# EAGLE design pogojig (EAGLE 6.4)
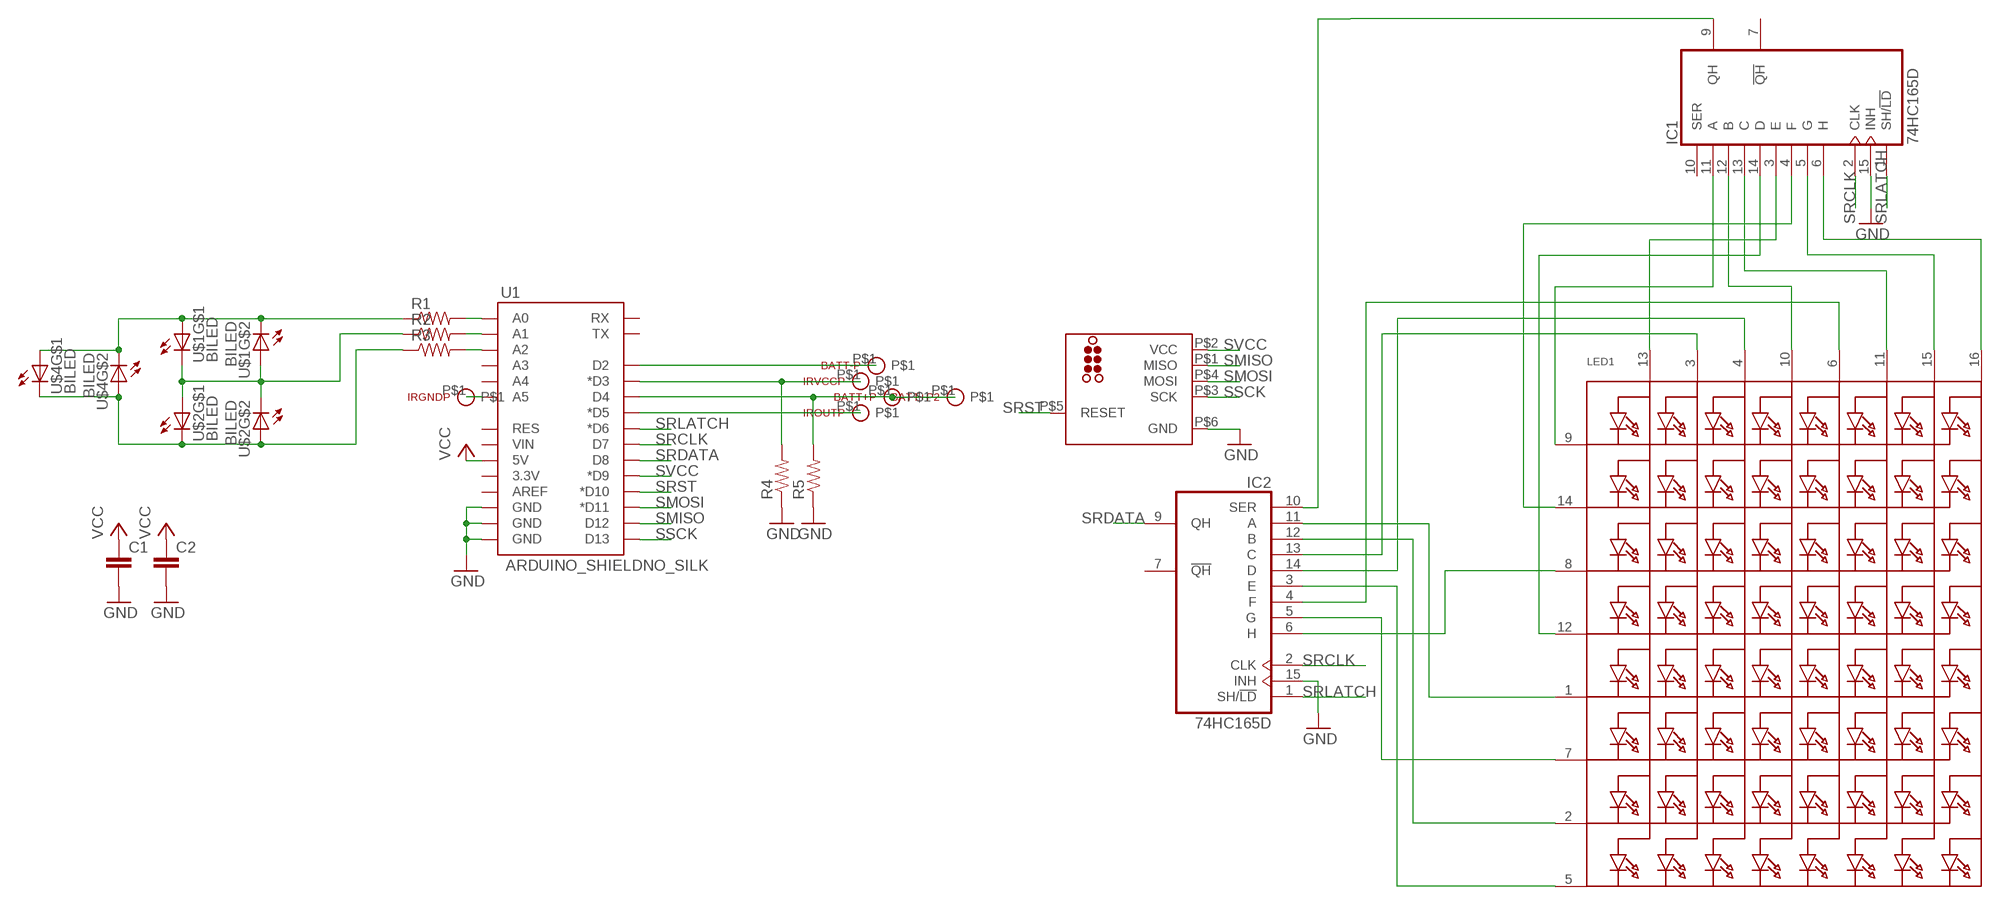
[diagram p0: schematic, sheet 1]

## Parts
BATT+P  POGOPIN1.02  [POGOPIN-1.02]
BATT+P2  POGOPIN1.02  [POGOPIN-1.02]
BATT-P  POGOPIN1.02  [POGOPIN-1.02]
C1  CAP0805  [0805]
C2  CAP0805  [0805]
IC1  74HC165D  [SO16]
IC2  74HC165D  [SO16]
IRGNDP  POGOPIN1.02  [POGOPIN-1.02]
IROUTP  POGOPIN1.02  [POGOPIN-1.02]
IRVCCP  POGOPIN1.02  [POGOPIN-1.02]
LED1  SEGMENT_8X8_ROWCATHODE  [SEGMENT-30MM-POGO]
R1  RESISTOR0805-RES  [0805]
R2  RESISTOR0805-RES  [0805]
R3  RESISTOR0805-RES  [0805]
R4  RESISTOR0805-RES  [0805]
R5  RESISTOR0805-RES  [0805]
U1  ARDUINO_SHIELDNO_SILK  [DUEMILANOVE_VIAS]
U$1  BILED  [BILED]
U$2  BILED  [BILED]
U$3  TC2030_AVR  [TC2030-MCP-NL-POGO]
U$4  BILED  [BILED]

## Nets
GND: C1.2 C2.2 IC1.15(INH) IC2.15(INH) R4.1 R5.1 U1.GND@0(GND) U1.GND@1(GND) U1.GND@2(GND) U$3.P$6(GND)
N$1: IC2.11(A) LED1.1(K5)
N$2: IC2.12(B) LED1.2(K7)
N$3: IC2.13(C) LED1.3(A2)
N$4: IC2.14(D) LED1.4(A3)
N$5: IC2.3(E) LED1.5(K8)
N$6: IC2.4(F) LED1.6(A5)
N$7: IC1.14(D) LED1.12(K4)
N$8: IC2.5(G) LED1.7(K6)
N$9: IC2.6(H) LED1.8(K3)
N$10: IC1.11(A) LED1.9(K1)
N$11: IC1.12(B) LED1.10(A4)
N$12: IC1.13(C) LED1.11(A6)
N$13: IC1.3(E) LED1.13(A1)
N$14: IC1.4(F) LED1.14(K2)
N$15: IC1.5(G) LED1.15(A7)
N$16: IC1.6(H) LED1.16(A8)
N$17: IC1.9(QH) IC2.10(SER)
N$18: IRGNDP.P$1 U1.A5
N$19: BATT+P2.P$1 BATT+P.P$1 R5.2 U1.D4
N$20: BATT-P.P$1 U1.D2
N$21: IRVCCP.P$1 R4.2 U1.D3(*D3)
N$22: IROUTP.P$1 U1.D5(*D5)
N$23: R3.2 U1.A2
N$24: R2.2 U1.A1
N$25: R1.2 U1.A0
N$26: R3.1 U$2.A2(A) U$2.C1(C) U$4.A2(A) U$4.C1(C)
N$27: R1.1 U$1.A1(A) U$1.C2(C) U$4.A1(A) U$4.C2(C)
N$28: R2.1 U$1.A2(A) U$1.C1(C) U$2.A1(A) U$2.C2(C)
SMISO: U1.D12 U$3.P$1(MISO)
SMOSI: U1.D11(*D11) U$3.P$4(MOSI)
SRCLK: IC1.2(CLK) IC2.2(CLK) U1.D7
SRDATA: IC2.9(QH) U1.D8
SRLATCH: IC1.1(SH/!LD) IC2.1(SH/!LD) U1.D6(*D6)
SRST: U1.D10(*D10) U$3.P$5(RESET)
SSCK: U1.D13 U$3.P$3(SCK)
SVCC: U1.D9(*D9) U$3.P$2(VCC)
VCC: C1.1 C2.1 U1.5V
Unconnected: IC1.7(!QH) IC1.10(SER) IC2.7(!QH) U1.3.3V U1.A3 U1.A4 U1.AREF U1.RES U1.RX U1.TX U1.VIN

## Power pins joined to a net without a drawn wire
GND: IC1.8(GND) IC2.8(GND)
VCC: IC1.16(VCC) IC2.16(VCC)

## Library data of the parts
BATT+P BATT+P2 BATT-P IRGNDP IROUTP IRVCCP = nickparts:POGOPIN
C1 C2 = SparkFun-Passives:CAP: Capacitor Standard 0603 ceramic capacitor, and 0.1" leaded capacitor.
IC1 IC2 = 74xx-eu:74*165: 8-bit parallel load SHIFT REGISTER
LED1 = nickparts:SEGMENT_8X8_ROWCATHODE: 8x8 LED Segment Displays: Row = Cathode 0.7" Red 8X8 Matrix, 1.9mm Round LEDs - BL-M07C881UR 1.2" Red 8x8 Matrix, 3.0mm Round LEDs - BL-M12A881UR 1.2" Red 8x8 Matrix, 3.0mm Square LEDs - BL-M12A883
R1-R5 = SparkFun-Passives:RESISTOR: Resistor Basic schematic elements and footprints for 0603, 1206, and PTH resistors.
U1 = SparkFun-Boards:ARDUINO_SHIELD: Arduino shield footprint
U$1 U$2 U$4 = nickparts:BILED
U$3 = nickparts:TC2030_AVR

## Board
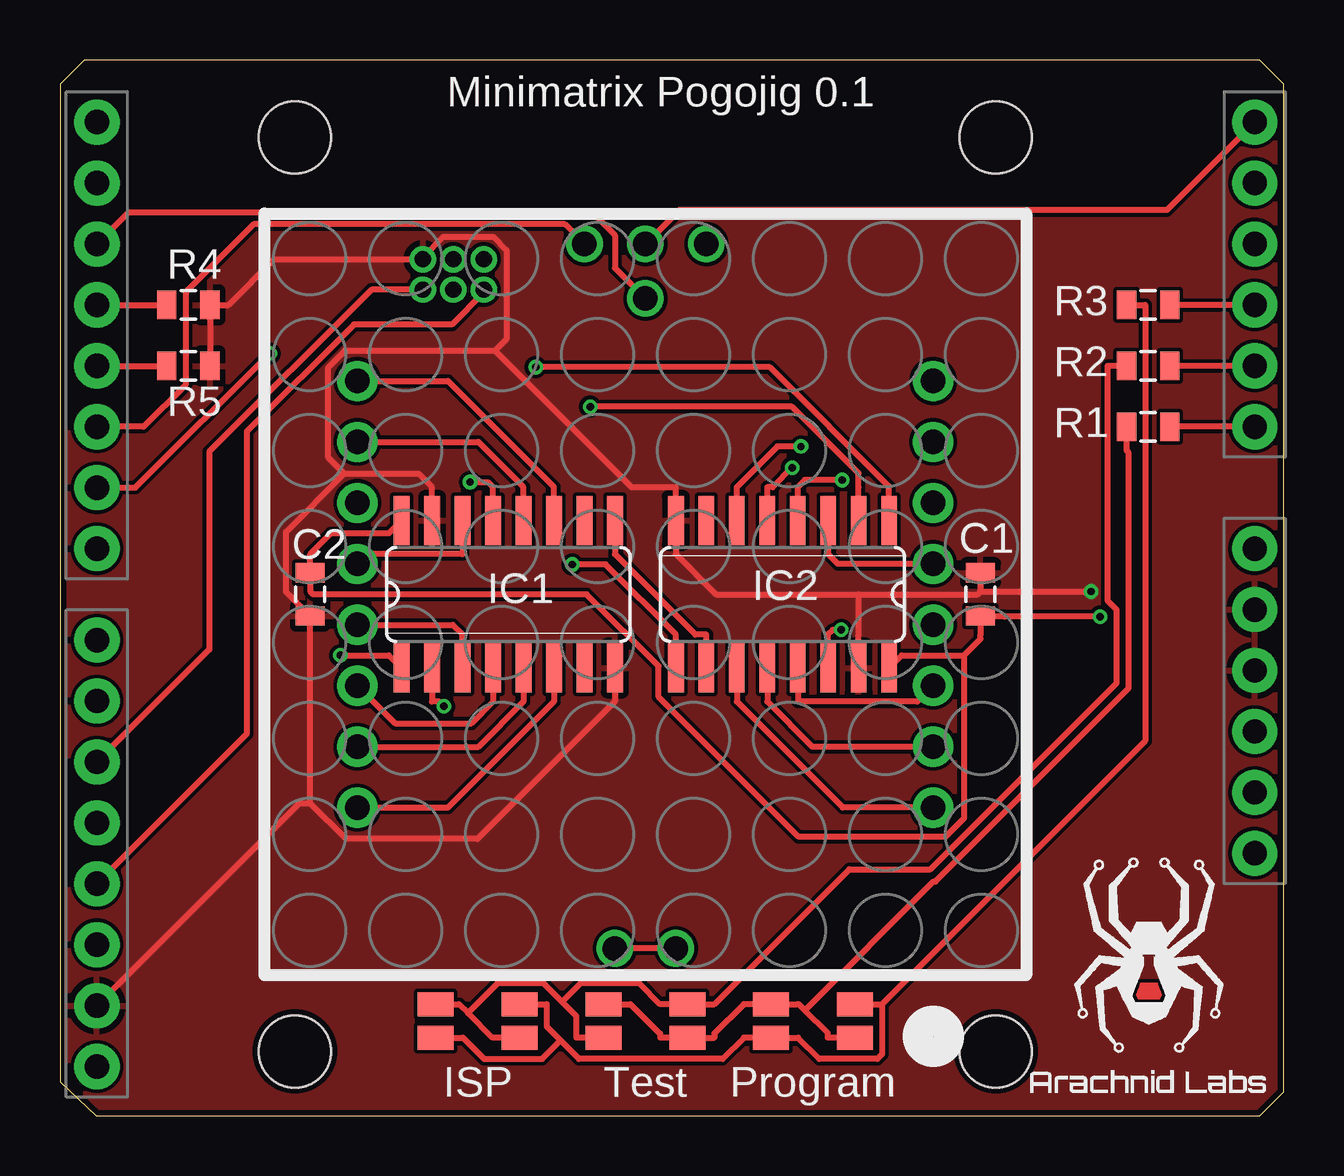
[diagram p1: board, top side]
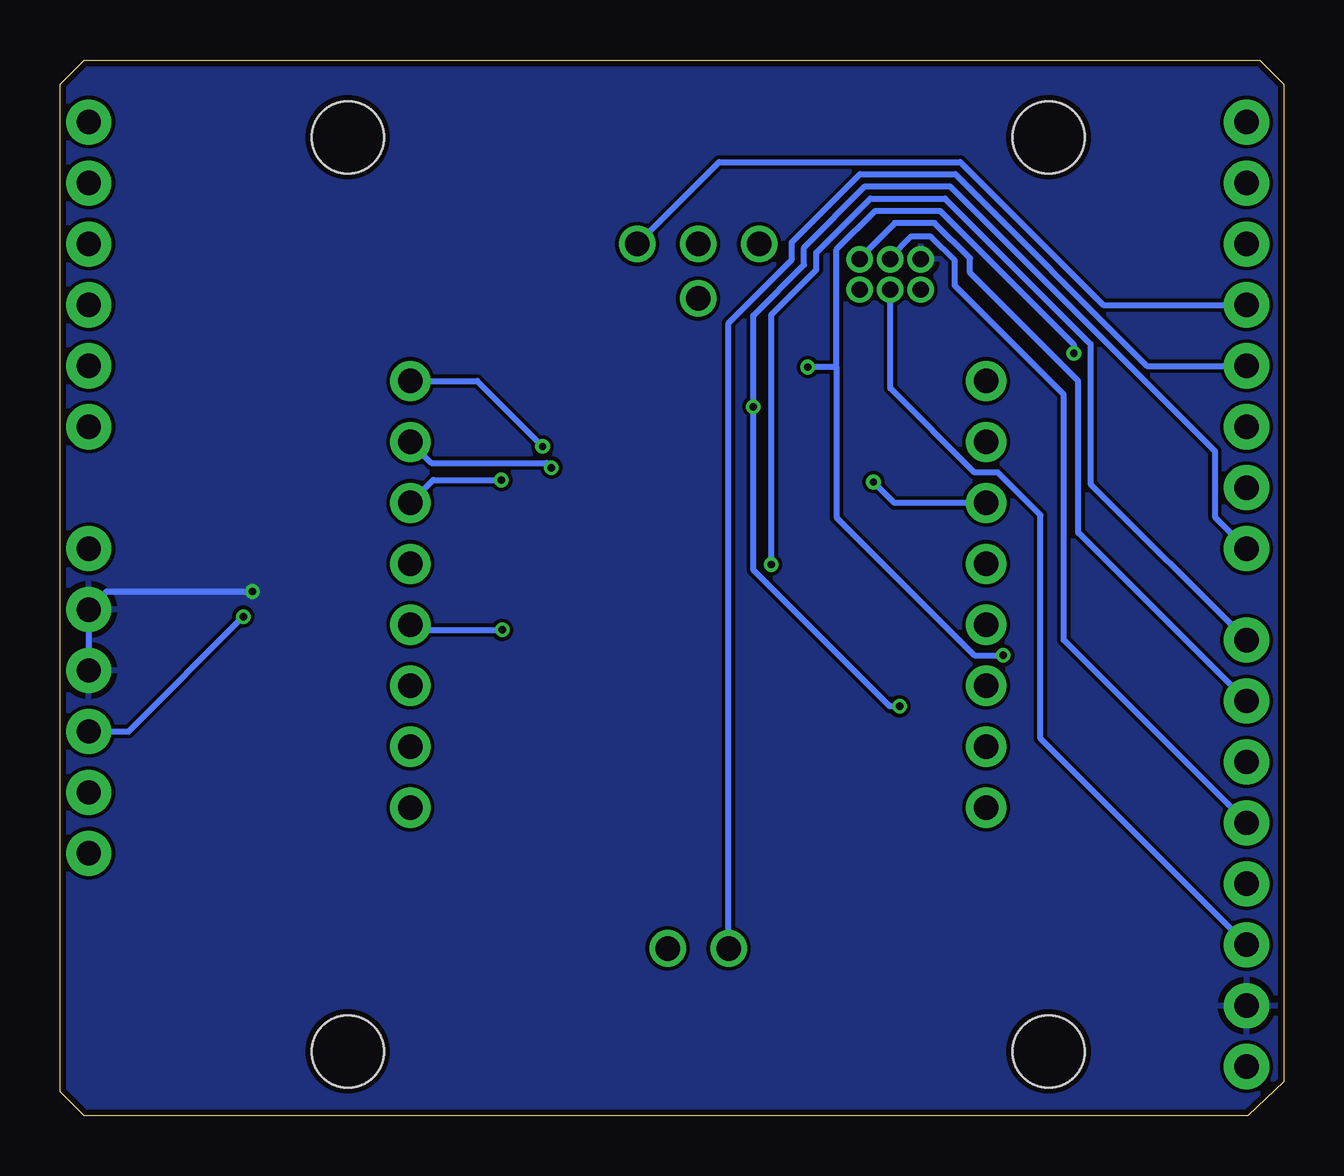
[diagram p2: board, bottom side, seen from below]

Size 51 x 44 mm. Coordinates in mm from the lower left corner, seen from the top.
Outline: 50,44 1,44 0,43 0,1.41 1.5,0 50,0 51,1 51,43 50,44
Copper layers (1*16): Top 0.035mm / dielectric 1.5mm / Bottom 0.035mm
Design rules "Fusion_eagle_rule_v1.1 *": minimum track width 6mil, minimum drill 0.3mm, track to track 6mil, track to pad 6mil, pad to pad 6mil, via to via 6mil, smd to smd 0mil, copper to edge 10mil, drill to drill 10mil, minimum pad ring 6mil, minimum via ring 6mil, stop-mask expansion 2mil, vias tented up to drill 100mil, thermal gap 10mil
Holes 3 mm at 9.79,40.77 39.01,40.77 39.01,2.67 9.79,2.67

### Footprints (pad centres in the part's own frame; a part is rotated, then mirrored left to right if it is on the bottom)
POGOPIN-1.02 = drill 1.02: P$1 0,0
0805 = smd 0.8 x 1.2: 1 -0.9,0; 2 0.9,0
SO16 = smd 0.66 x 2.032: 1 -4.445,-3.073; 2 -3.175,-3.073; 3 -1.905,-3.073; 4 -0.635,-3.073; 5 0.635,-3.073; 6 1.905,-3.073; 7 3.175,-3.073; 8 4.445,-3.073; 9 4.445,3.073; 10 3.175,3.073; 11 1.905,3.073; 12 0.635,3.073; 13 -0.635,3.073; 14 -1.905,3.073; 15 -3.175,3.073; 16 -4.445,3.073
SEGMENT-30MM-POGO = drill 1.02 pad 1.676: 1 -8.89,-12; 2 -6.35,-12; 3 -3.81,-12; 4 -1.27,-12; 5 1.27,-12; 6 3.81,-12; 7 6.35,-12; 8 8.89,-12; 9 8.89,12; 10 6.35,12; 11 3.81,12; 12 1.27,12; 13 -1.27,12; 14 -3.81,12; 15 -6.35,12; 16 -8.89,12
DUEMILANOVE_VIAS = drill 1.016 pad 1.88: 3.3V 50.8,13.97; 5V 50.8,16.51; A0 50.8,29.21; A1 50.8,31.75; A2 50.8,34.29; A3 50.8,36.83; A4 50.8,39.37; A5 50.8,41.91; AREF 2.54,2.54; D2 2.54,36.83; D3 2.54,34.29; D4 2.54,31.75; D5 2.54,29.21; D6 2.54,26.67; D7 2.54,24.13; D8 2.54,20.32; D9 2.54,17.78; D10 2.54,15.24; D11 2.54,12.7; D12 2.54,10.16; D13 2.54,7.62; GND@0 50.8,19.05; GND@1 50.8,21.59; GND@2 2.54,5.08; RES 50.8,11.43; RX 2.54,41.91; TX 2.54,39.37; VIN 50.8,24.13
BILED = smd 1.5 x 1: A1 -1.75,0.7; A2 -1.75,-0.7; C1 1.75,0.7; C2 1.75,-0.7
TC2030-MCP-NL-POGO = drill 0.68 pad 1.1: P$1 1.27,-0.635; P$2 1.27,0.635; P$3 2.54,-0.635; P$4 2.54,0.635; P$5 3.81,-0.635; P$6 3.81,0.635

### Placement (x,y rotation side)
BATT+P  23.13,6.97 0 top
BATT+P2  25.67,6.97 0 top
BATT-P  24.4,34.06 0 top
C1  38.37,21.73 90 top
C2  10.43,21.73 270 top
IC1  18.68,21.73 0 top
IC2  30.11,21.73 180 top
IRGNDP  24.4,36.33 0 top
IROUTP  21.86,36.33 0 top
IRVCCP  26.94,36.33 0 top
LED1  24.4,21.73 90 top
R1  45.35,28.71 0 top
R2  45.35,31.25 0 top
R3  45.35,33.79 0 top
R4  5.35,33.79 180 top
R5  5.35,31.25 180 top
U1  -1,-0.5 0 top
U$1  24.4,3.95 180 top
U$2  17.41,3.95 180 top
U$3  18.93,35.06 0 bottom
U$4  31.39,3.95 0 top
U$5  [ARACHNID_LABS_LOGO_SM]  45.35,5.85 0 top

### Tracks (layer width: path | path; a pad name or v marks a point on that pad's centre or on a via)
GND  (via drill 0.3 pad 0.61)
  Top 0.254: 38.37,21.84 v42.98,21.84 | 18.14,31.89 23.83,26.2 25.67,26.2 IC2.8 25.67,23.4 27.35,21.73 33.29,21.73 | 11.85,26.76 11.18,27.42 11.18,31.19 11.88,31.89 18.14,31.89 | 18.14,31.89 18.61,32.36 18.61,36.08 18.07,36.63 15.98,36.63 15.12,35.78 U$3.P$6 8.94,35.7 7.03,33.79 R4.1 R5.1 | 11.85,26.76 14.95,26.76 15.51,26.2 IC1.15 | 11.85,26.76 9.42,24.33 9.42,21.83 C2.2 10.43,13.02 | 33.29,21.73 38.25,21.73 38.37,21.84 | 33.29,21.73 33.29,20.05 IC2.15 | C1.2 38.37,21.84 | IC1.8 23.13,17.25 17.4,11.52 11.92,11.52 10.43,13.02 | U1.GND@2 9.97,13.02 10.43,13.02
  Bottom 0.254: v42.98,21.84 49.05,21.84 U1.GND@1 U1.GND@0
  pour Bottom: 1,44 50,44 51,43 51,1 50,0 1.5,0 0,1.41 0,43
  pour Top: 1,44 50,44 51,43 51,1 50,0 1.5,0 0,1.41 0,43
N$1
  Top 0.254: LED1.1 32.63,12.84 28.21,17.25 IC2.11
N$2
  Top 0.254: LED1.2 31.36,15.38 29.48,17.25 IC2.12
N$3
  Top 0.254: IC2.13 30.75,17.25 35.74,17.25 LED1.3
N$4  (via drill 0.3 pad 0.61)
  Top 0.254: v32.57,20.24 32.22,20.24 32.02,20.05 IC2.14
  Bottom 0.254: LED1.4 36.19,20.24 v32.57,20.24
N$5
  Top 0.254: IC2.3 32.02,23.4 32.43,23 LED1.5
N$6  (via drill 0.3 pad 0.61)
  Top 0.254: IC2.4 30.75,26.2 31.05,26.49 v32.6,26.49
  Bottom 0.254: LED1.6 35.44,26.49 v32.6,26.49
N$7
  Top 0.254: IC1.14 16.78,23.4 12.81,23.4 LED1.12
N$8  (via drill 0.3 pad 0.61)
  Top 0.254: IC2.5 29.48,26.2 29.71,26.2 v30.52,27
  Bottom 0.254: LED1.7 35.53,27.2 30.71,27.2 v30.52,27
N$9  (via drill 0.3 pad 0.61)
  Top 0.254: IC2.6 28.21,26.2 29.9,27.89 v30.89,27.89
  Bottom 0.254: LED1.8 33.61,30.61 v30.89,27.89
N$10
  Top 0.254: LED1.9 16.17,30.61 20.59,26.2 IC1.11
N$11
  Top 0.254: LED1.10 17.44,28.07 19.32,26.2 IC1.12
N$12  (via drill 0.3 pad 0.61)
  Top 0.254: v17.09,26.4 17.84,26.4 18.05,26.2 IC1.13
  Bottom 0.254: LED1.11 16.23,25.54 v17.09,26.4
N$13
  Top 0.254: IC1.3 16.78,20.05 16.37,20.45 LED1.13
N$14
  Top 0.254: IC1.4 18.05,17.25 17.15,16.35 13.96,16.35 LED1.14
N$15
  Top 0.254: LED1.15 17.44,15.38 19.32,17.25 IC1.5
N$16
  Top 0.254: LED1.16 16.17,12.84 20.59,17.25 IC1.6
N$17
  Top 0.254: IC2.10 26.94,20.05 26.48,20.05 23.13,23.4 IC1.9
N$18
  Top 0.254: U1.A5 46.14,37.75 25.82,37.75 IRGNDP.P$1
N$19
  Top 0.254: BATT+P2.P$1 BATT+P.P$1 | U1.D4 R5.2
  Bottom 0.254: BATT+P.P$1 23.13,33.04 20.49,35.68 20.49,36.4 17.65,39.24 13.69,39.24 5.7,31.25 U1.D4
N$20
  Top 0.254: U1.D2 2.86,37.65 22.18,37.65 23.13,36.7 23.13,35.33 BATT-P.P$1
N$21
  Top 0.254: U1.D3 R4.2
  Bottom 0.254: IRVCCP.P$1 23.52,39.75 13.48,39.75 7.52,33.79 U1.D3
N$22
  Top 0.254: IROUTP.P$1 21.04,37.15 8.06,37.15 5.23,34.31 5.23,30.46 3.48,28.71 U1.D5
N$23
  Top 0.254: U1.A2 R3.2
N$24
  Top 0.254: U1.A1 R2.2
N$25
  Top 0.254: U1.A0 R1.2
N$26
  Top 0.254: 34.27,4.64 34.27,2.56 34.07,2.36 31.65,2.36 30.77,3.25 U$4.A2 28.5,3.25 27.62,2.36 21.64,2.36 20.87,3.13 | 34.27,4.64 45.24,15.61 45.24,33.79 R3.1 | U$4.C1 34.27,4.64 | 20.87,3.13 20.3,3.7 20.3,4.64 U$2.A2 | 20.87,3.13 20.1,2.36 17.68,2.36 16.8,3.25 U$2.C1
N$27
  Top 0.254: R1.1 44.45,27.73 44.55,27.63 44.55,17.82 36.49,9.76 36.42,9.76 31.05,4.39 | 31.05,4.39 30.8,4.64 30.73,4.64 U$4.A1 28.5,4.64 27.28,3.42 27.28,3.25 U$1.A1 25.02,3.25 25.02,3.41 23.78,4.64 U$1.C2 | 31.05,4.39 32,3.44 32,3.25 U$4.C2
N$28
  Top 0.254: 20.93,4.74 21.52,4.15 21.52,3.25 U$1.C1 | 17,4.28 18.25,5.53 20.14,5.53 20.93,4.74 | 20.93,4.74 21.72,5.53 24.14,5.53 25.02,4.64 U$1.A2 27.28,4.64 32.9,10.27 36.28,10.27 44.04,18.03 44.04,21.08 43.67,21.45 43.67,31.25 R2.1 | 17,4.28 18.03,3.25 U$2.A1 | 17,4.28 16.63,4.64 15.95,4.64 U$2.C2
SMISO
  Top 0.254: U$3.P$1 17.66,34.3 16.34,32.98 12.25,32.98 7.79,28.52 7.79,15.91 U1.D12
SMOSI
  Bottom 0.254: U1.D11 9.16,19.82 9.16,30.05 13.71,34.6 13.71,35.65 14.69,36.63 15.53,36.63 16.39,35.77 U$3.P$4
SRCLK  (via drill 0.3 pad 0.61)
  Top 0.254: v22.1,29.55 30.52,29.55 33.29,26.77 33.29,26.2 IC2.2 | v16,17.06 15.81,17.25 15.51,17.25 IC1.2
  Bottom 0.254: v22.1,29.55 22.1,33.35 19.98,35.47 19.98,36.19 17.44,38.73 13.9,38.73 2.86,27.7 2.86,24.95 U1.D7 | v16,17.06 16.41,17.06 22.1,22.75 v22.1,29.55 | v22.1,29.55
SRDATA  (via drill 0.3 pad 0.61)
  Top 0.254: IC2.9 25.67,20.05 22.75,22.97 v21.35,22.97
  Bottom 0.254: v21.35,22.97 21.35,33.38 19.48,35.26 19.48,35.98 17.23,38.22 14.11,38.22 8.04,32.16 8.04,26.32 U1.D8
SRLATCH  (via drill 0.3 pad 0.61)
  Top 0.254: U1.D6 3.14,26.17 v8.74,31.77 | v19.83,31.2 29.59,31.2 34.56,26.22 34.56,26.2 IC2.1 | v11.68,19.18 13.71,19.18 IC1.1
  Bottom 0.254: 18.63,31.2 18.63,36.11 17.02,37.72 14.32,37.72 8.74,32.14 v8.74,31.77 | 18.63,31.2 18.63,24.93 12.88,19.18 v11.68,19.18 | 18.63,31.2 v19.83,31.2
SRST
  Top 0.254: U$3.P$5 12.98,34.42 6.23,27.67 6.23,19.43 U1.D10
SSCK
  Bottom 0.254: U1.D13 10.13,15.71 10.13,25.02 11.91,26.8 12.88,26.8 16.39,30.32 U$3.P$3
SVCC
  Bottom 0.254: U1.D9 8.55,24.29 8.55,30.61 13.07,35.13 13.07,35.73 14.55,37.21 16.2,37.21 17.66,35.74 U$3.P$2
VCC  (via drill 0.3 pad 0.61)
  Top 0.254: v43.36,20.8 39.38,20.8 39.35,20.82 C1.1 38.37,20.04 38.37,19.87 37.68,19.18 | IC2.16 35.09,19.18 37.68,19.18 | 37.68,19.18 37.68,12.39 36.91,11.62 30.79,11.62 24.95,17.45 24.95,18.73 21.96,21.73 10.55,21.73 10.43,21.84 C2.1 10.43,23.41 11.29,24.27 13.71,24.27 IC1.16
  Bottom 0.254: U1.5V 48.14,16.01 v43.36,20.8

### Text on the board
tPlace: Minimatrix Pogojig 0.1 | ISP | Test | Program